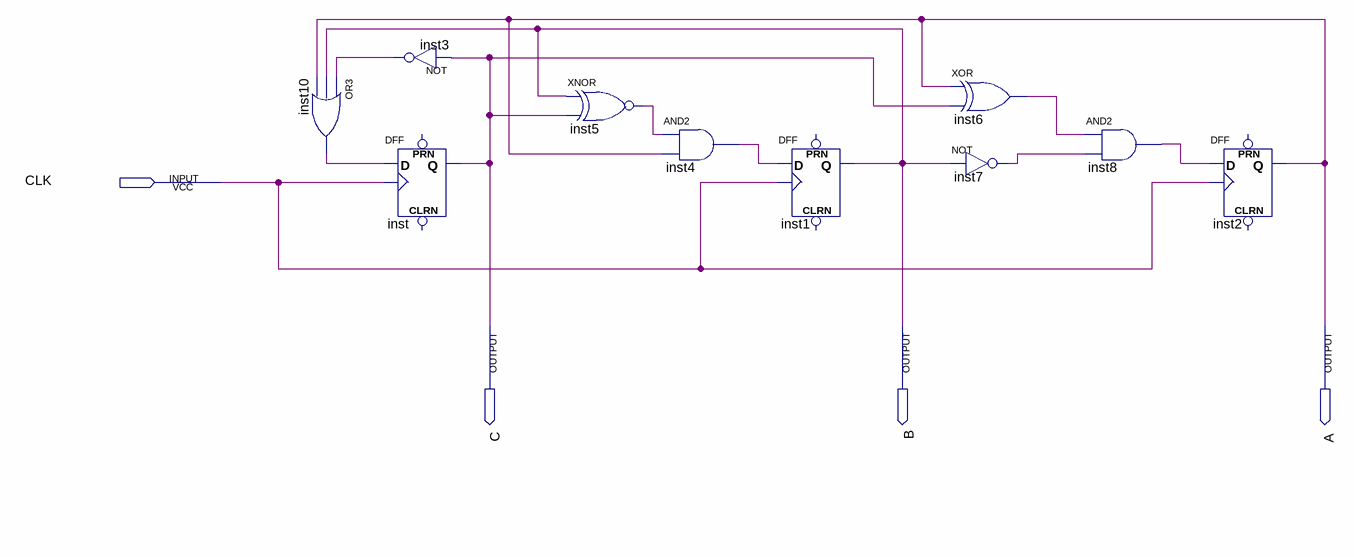
[diagram p0: schematic sheet]
// Quartus schematic LABKiemtra.bdf as structural Verilog: 10 symbols, 4 pins
module LABKiemtra (
  input  CLK,
  output C,
  output B,
  output A
);

  wire inst3_out, inst4_out, inst5_out, inst6_out, inst7_out, inst8_out, inst10_out;

  or inst10 (inst10_out, inst3_out, B, A);
  not inst3 (inst3_out, C);
  DFF inst (.CLK(CLK), .D(inst10_out), .Q(C));  // open: CLRN, PRN
  xnor inst5 (inst5_out, B, C);
  and inst4 (inst4_out, inst5_out, A);
  DFF inst1 (.CLK(CLK), .D(inst4_out), .Q(B));  // open: CLRN, PRN
  xor inst6 (inst6_out, A, C);
  not inst7 (inst7_out, B);
  and inst8 (inst8_out, inst6_out, inst7_out);
  DFF inst2 (.CLK(CLK), .D(inst8_out), .Q(A));  // open: CLRN, PRN
endmodule
